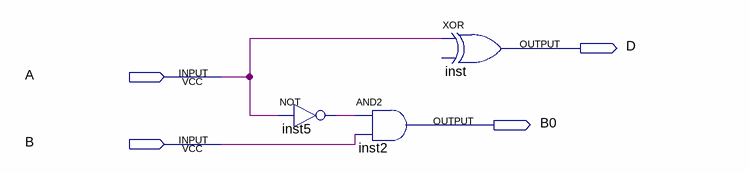
[diagram p0: schematic sheet]
// Quartus schematic HSUM_SCH.bdf as structural Verilog: 3 symbols, 4 pins
module HSUM_SCH (
  input  A,
  input  B,
  output D,
  output B0
);

  wire inst5_out;

  not inst5 (inst5_out, A);
  and inst2 (B0, inst5_out, B);
  buf inst (D, A);  // XOR open: IN2
endmodule
